# Altium schematic sheet 01 - Notes.SchDoc: 25kW WolfPACK FM3 Six-Pack Inverter
size 431 x 279 mm; Date: 07/2023; DocumentNumber: CRD25DA12N-FMC; Revision: 1.1; SheetNumber: 1; SheetTotal: 8; SheetSize: B
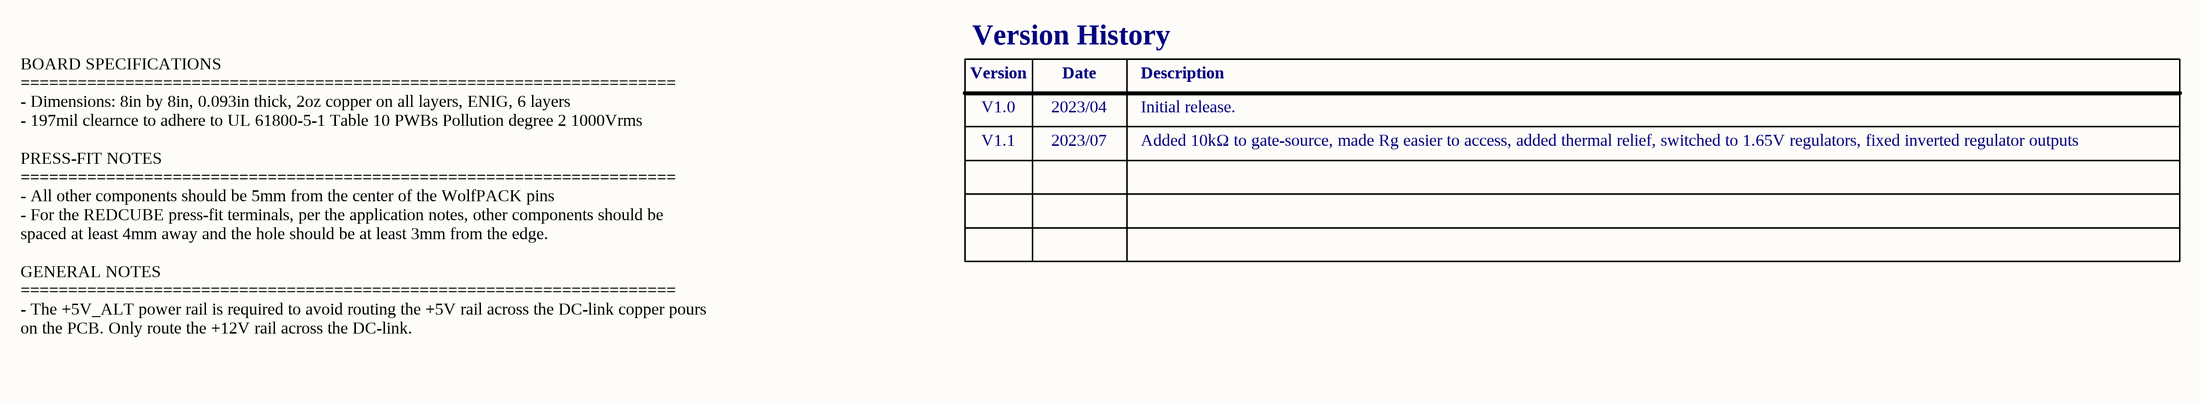
[diagram p0: 01 - Notes.SchDoc]

## Notes on the sheet
- Version History
- Version
- Date
- Description
- V1.0
- V1.1
- 2023/04
- 2023/07
- Initial release.
- Added 10kΩ to gate-source, made Rg easier to access, added thermal relief, switched to 1.65V regulators, fixed inverted regulator outputs
- BOARD SPECIFICATIONS
  =====================================================================
  - Dimensions: 8in by 8in, 0.093in thick, 2oz copper on all layers, ENIG, 6 layers
  - 197mil clearnce to adhere to UL 61800-5-1 Table 10 PWBs Pollution degree 2 1000Vrms
  PRESS-FIT NOTES
  =====================================================================
  - All other components should be 5mm from the center of the WolfPACK pins
  - For the REDCUBE press-fit terminals, per the application notes, other components should be spaced at least 4mm away and the hole should be at least 3mm from the edge.
  GENERAL NOTES
  =====================================================================
  - The +5V_ALT power rail is required to avoid routing the +5V rail across the DC-link copper pours on the PCB. Only route the +12V rail across the DC-link.
- Title:
- Date:
- Drawing No:
- Size:
- Revision:
- Sheet:
- of